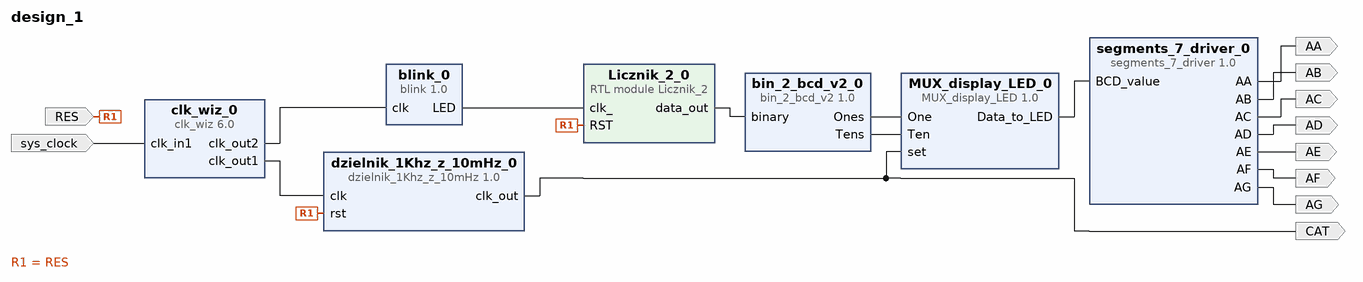
[diagram p0: block diagram of the top level]
# Vivado block design design_1, xc7z020clg400-1, Vivado 2020.1
create_bd_design design_1

create_bd_port -dir I -type clk sys_clock
set_property -dict {CONFIG.FREQ_HZ 125000000 CONFIG.PHASE 0.000} [get_bd_ports sys_clock]
create_bd_port -dir I -type rst RES
set_property -dict {CONFIG.POLARITY ACTIVE_HIGH} [get_bd_ports RES]
create_bd_port -dir O AA
create_bd_port -dir O AB
create_bd_port -dir O AC
create_bd_port -dir O AD
create_bd_port -dir O AE
create_bd_port -dir O AF
create_bd_port -dir O AG
create_bd_port -dir O CAT

create_bd_cell -type ip -vlnv xilinx.com:ip:clk_wiz:6.0 clk_wiz_0
set_property -dict [list \
  CONFIG.CLKOUT1_JITTER 197.700 \
  CONFIG.CLKOUT1_REQUESTED_OUT_FREQ 10.000 \
  CONFIG.CLKOUT2_JITTER 143.688 \
  CONFIG.CLKOUT2_PHASE_ERROR 96.948 \
  CONFIG.CLKOUT2_REQUESTED_OUT_FREQ 50.000 \
  CONFIG.CLKOUT2_USED true \
  CONFIG.CLK_IN1_BOARD_INTERFACE sys_clock \
  CONFIG.MMCM_CLKOUT0_DIVIDE_F 100.000 \
  CONFIG.MMCM_CLKOUT1_DIVIDE 20 \
  CONFIG.NUM_OUT_CLKS 2 \
  CONFIG.USE_BOARD_FLOW true \
  CONFIG.USE_LOCKED false \
  CONFIG.USE_RESET false \
] [get_bd_cells clk_wiz_0]
create_bd_cell -type ip -vlnv user.org:user:dzielnik_1Khz_z_10mHz:1.0 dzielnik_1Khz_z_10mHz_0
create_bd_cell -type ip -vlnv user.org:user:segments_7_driver:1.0 segments_7_driver_0
create_bd_cell -type ip -vlnv user.org:user:blink:1.0 blink_0
create_bd_cell -type ip -vlnv user.org:user:bin_2_bcd_v2:1.0 bin_2_bcd_v2_0
create_bd_cell -type ip -vlnv user.org:user:MUX_display_LED:1.0 MUX_display_LED_0
create_bd_cell -type module -reference Licznik_2 Licznik_2_0

# ---- connections ----

connect_bd_net [get_bd_ports sys_clock] [get_bd_pins clk_wiz_0/clk_in1]
connect_bd_net [get_bd_pins clk_wiz_0/clk_out2] [get_bd_pins blink_0/clk]
connect_bd_net [get_bd_pins clk_wiz_0/clk_out1] [get_bd_pins dzielnik_1Khz_z_10mHz_0/clk]
connect_bd_net [get_bd_pins bin_2_bcd_v2_0/Ones] [get_bd_pins MUX_display_LED_0/One]
connect_bd_net [get_bd_pins bin_2_bcd_v2_0/Tens] [get_bd_pins MUX_display_LED_0/Ten]
connect_bd_net [get_bd_pins MUX_display_LED_0/Data_to_LED] [get_bd_pins segments_7_driver_0/BCD_value]
connect_bd_net [get_bd_ports RES] [get_bd_pins dzielnik_1Khz_z_10mHz_0/rst] [get_bd_pins Licznik_2_0/RST]
connect_bd_net [get_bd_pins segments_7_driver_0/AA] [get_bd_ports AA]
connect_bd_net [get_bd_pins segments_7_driver_0/AB] [get_bd_ports AB]
connect_bd_net [get_bd_pins segments_7_driver_0/AC] [get_bd_ports AC]
connect_bd_net [get_bd_pins segments_7_driver_0/AD] [get_bd_ports AD]
connect_bd_net [get_bd_pins segments_7_driver_0/AE] [get_bd_ports AE]
connect_bd_net [get_bd_pins segments_7_driver_0/AF] [get_bd_ports AF]
connect_bd_net [get_bd_pins segments_7_driver_0/AG] [get_bd_ports AG]
connect_bd_net [get_bd_pins dzielnik_1Khz_z_10mHz_0/clk_out] [get_bd_pins MUX_display_LED_0/set] [get_bd_ports CAT]
connect_bd_net [get_bd_pins blink_0/LED] [get_bd_pins Licznik_2_0/clk_]
connect_bd_net [get_bd_pins Licznik_2_0/data_out] [get_bd_pins bin_2_bcd_v2_0/binary]

validate_bd_design
save_bd_design
